# Altium schematic sheet Project_Information.SchDoc: =project_title
size Tabloid; CompanyName: Luxonis Holding; Organization: Luxonis Holding; Address1: 1925 Harmony Park Drive; Address2: Westminster, CO; Address3: 80234; Address4: United States; SheetNumber: 1; SheetTotal: 3
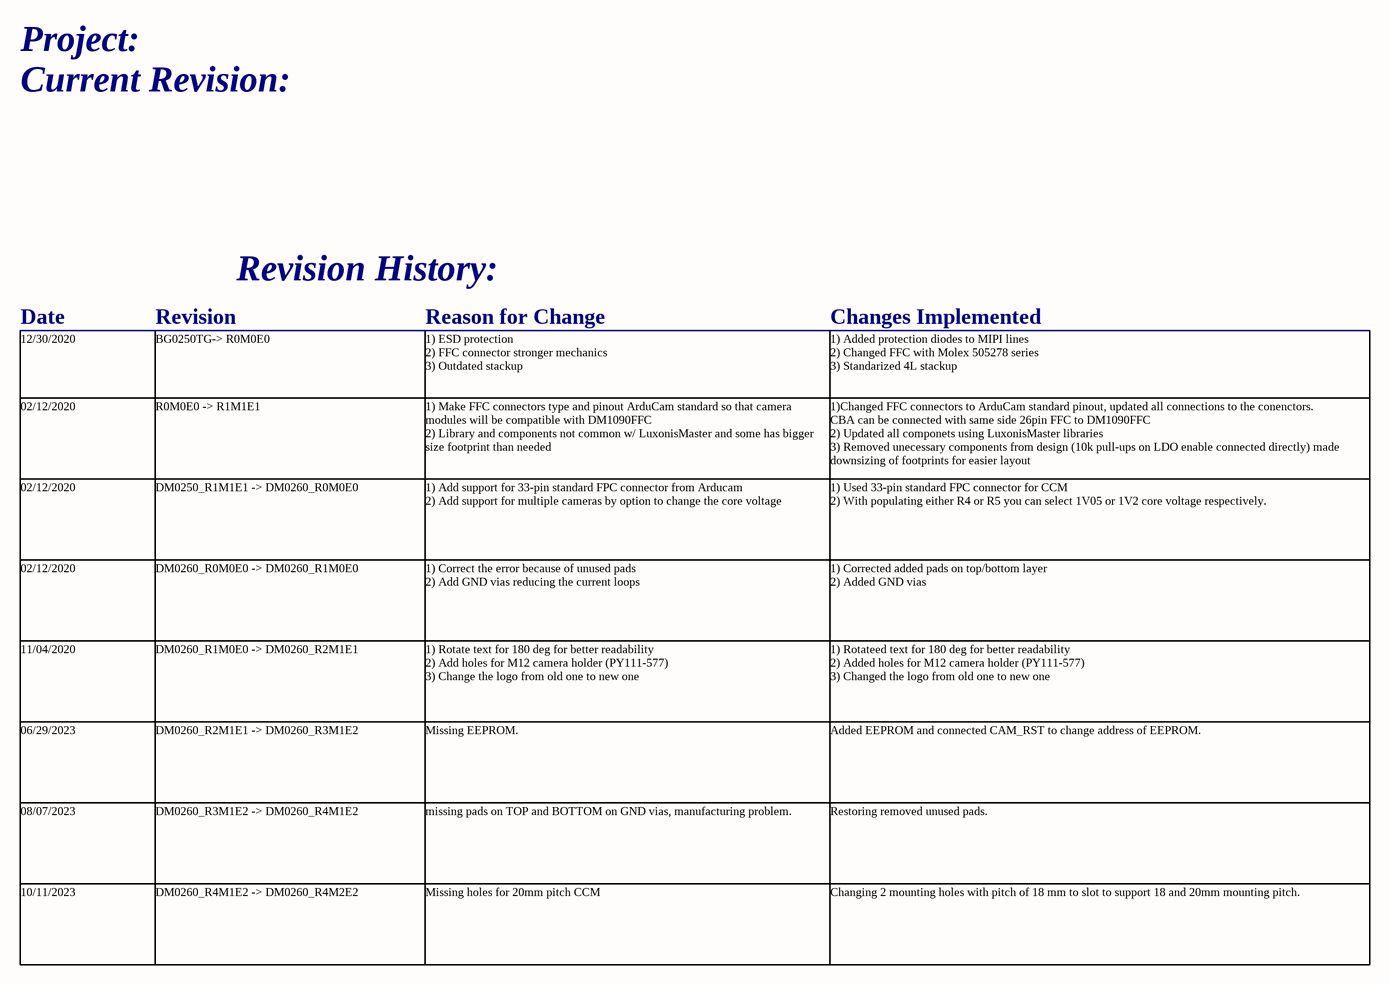
[diagram p0: Project_Information.SchDoc]

## Notes on the sheet
- Project:
- Current Revision:
- Revision History:
- Date
- Revision
- Reason for Change
- Changes Implemented
- 12/30/2020
- BG0250TG-> R0M0E0
- 1) ESD protection
  2) FFC connector stronger mechanics
  3) Outdated stackup
- 1) Added protection diodes to MIPI lines
  2) Changed FFC with Molex 505278 series
  3) Standarized 4L stackup
- 02/12/2020
- R0M0E0 -> R1M1E1
- 1) Make FFC connectors type and pinout ArduCam standard so that camera modules will be compatible with DM1090FFC
  2) Library and components not common w/ LuxonisMaster and some has bigger size footprint than needed
- 1)Changed FFC connectors to ArduCam standard pinout, updated all connections to the conenctors.
  CBA can be connected with same side 26pin FFC to DM1090FFC
  2) Updated all componets using LuxonisMaster libraries
  3) Removed unecessary components from design (10k pull-ups on LDO enable connected directly) made downsizing of footprints for easier layout
- DM0250_R1M1E1 -> DM0260_R0M0E0
- 1) Add support for 33-pin standard FPC connector from Arducam
  2) Add support for multiple cameras by option to change the core voltage
- 1) Used 33-pin standard FPC connector for CCM
  2) With populating either R4 or R5 you can select 1V05 or 1V2 core voltage respectively.
- DM0260_R0M0E0 -> DM0260_R1M0E0
- 1) Correct the error because of unused pads
  2) Add GND vias reducing the current loops
- 1) Corrected added pads on top/bottom layer
  2) Added GND vias
- 11/04/2020
- DM0260_R1M0E0 -> DM0260_R2M1E1
- 1) Rotate text for 180 deg for better readability
  2) Add holes for M12 camera holder (PY111-577)
  3) Change the logo from old one to new one
- 1) Rotateed text for 180 deg for better readability
  2) Added holes for M12 camera holder (PY111-577)
  3) Changed the logo from old one to new one
- 06/29/2023
- DM0260_R2M1E1 -> DM0260_R3M1E2
- Missing EEPROM.
- Added EEPROM and connected CAM_RST to change address of EEPROM.
- 08/07/2023
- DM0260_R3M1E2 -> DM0260_R4M1E2
- missing pads on TOP and BOTTOM on GND vias, manufacturing problem.
- Restoring removed unused pads.
- 10/11/2023
- DM0260_R4M1E2 -> DM0260_R4M2E2
- Missing holes for 20mm pitch CCM
- Changing 2 mounting holes with pitch of 18 mm to slot to support 18 and 20mm mounting pitch.
- Title
- Size:
- Date:
- Tabloid
- Number:
- Time:
- Revision:
- Sheet
- of
- Drawn by: